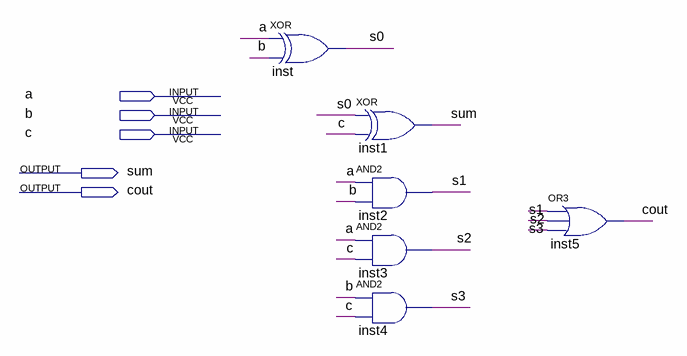
[diagram p0: schematic sheet]
// Quartus schematic FA.bdf as structural Verilog: 6 symbols, 5 pins
module FA (
  input  a,
  input  b,
  input  c,
  output sum,
  output cout
);

  wire s0, s1, s2, s3;

  xor inst (s0, a, b);
  xor inst1 (sum, s0, c);
  and inst2 (s1, a, b);
  and inst3 (s2, a, c);
  and inst4 (s3, b, c);
  or inst5 (cout, s1, s2, s3);
endmodule
